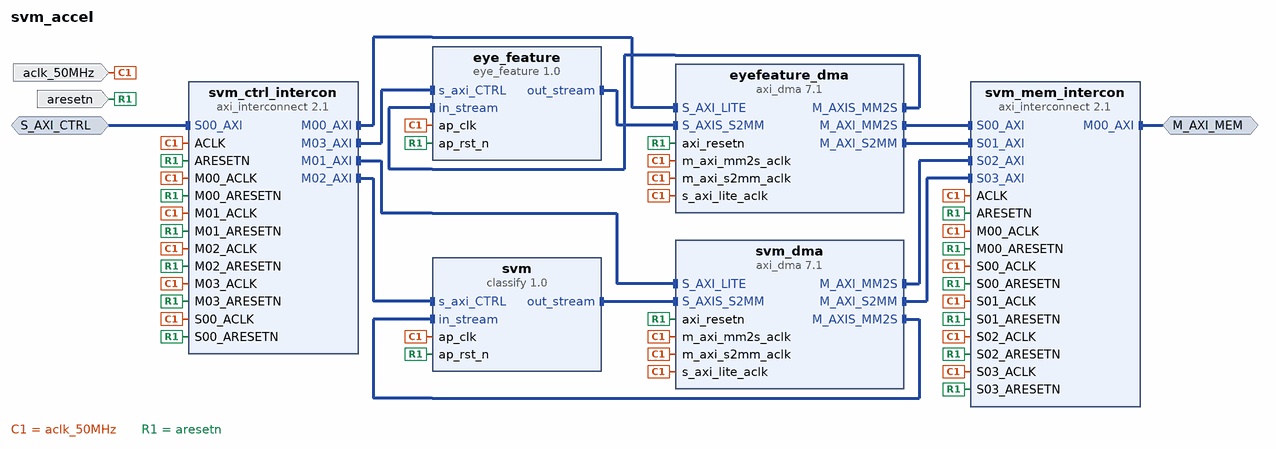
[diagram p0: block diagram of the top level]
# Vivado block design svm_accel, xc7z020clg400-1, Vivado 2023.2
create_bd_design svm_accel

create_bd_intf_port -mode Slave -vlnv xilinx.com:interface:aximm_rtl:1.0 S_AXI_CTRL
set_property -dict [list \
  CONFIG.ADDR_WIDTH 32 \
  CONFIG.ARUSER_WIDTH 0 \
  CONFIG.AWUSER_WIDTH 0 \
  CONFIG.BUSER_WIDTH 0 \
  CONFIG.DATA_WIDTH 32 \
  CONFIG.FREQ_HZ 50000000 \
  CONFIG.HAS_BRESP 1 \
  CONFIG.HAS_BURST 1 \
  CONFIG.HAS_CACHE 1 \
  CONFIG.HAS_LOCK 1 \
  CONFIG.HAS_PROT 1 \
  CONFIG.HAS_QOS 1 \
  CONFIG.HAS_REGION 0 \
  CONFIG.HAS_RRESP 1 \
  CONFIG.HAS_WSTRB 1 \
  CONFIG.ID_WIDTH 12 \
  CONFIG.MAX_BURST_LENGTH 16 \
  CONFIG.NUM_READ_OUTSTANDING 8 \
  CONFIG.NUM_READ_THREADS 4 \
  CONFIG.NUM_WRITE_OUTSTANDING 8 \
  CONFIG.NUM_WRITE_THREADS 4 \
  CONFIG.PROTOCOL AXI3 \
  CONFIG.READ_WRITE_MODE READ_WRITE \
  CONFIG.RUSER_BITS_PER_BYTE 0 \
  CONFIG.RUSER_WIDTH 0 \
  CONFIG.SUPPORTS_NARROW_BURST 0 \
  CONFIG.WUSER_BITS_PER_BYTE 0 \
  CONFIG.WUSER_WIDTH 0 \
] [get_bd_intf_ports S_AXI_CTRL]
create_bd_intf_port -mode Master -vlnv xilinx.com:interface:aximm_rtl:1.0 M_AXI_MEM
set_property -dict [list \
  CONFIG.ADDR_WIDTH 32 \
  CONFIG.DATA_WIDTH 64 \
  CONFIG.FREQ_HZ 50000000 \
  CONFIG.HAS_BURST 0 \
  CONFIG.HAS_LOCK 0 \
  CONFIG.HAS_QOS 0 \
  CONFIG.HAS_REGION 0 \
  CONFIG.NUM_READ_OUTSTANDING 8 \
  CONFIG.NUM_WRITE_OUTSTANDING 8 \
  CONFIG.PROTOCOL AXI3 \
] [get_bd_intf_ports M_AXI_MEM]
create_bd_port -dir I -type clk aclk_50MHz
set_property -dict {CONFIG.FREQ_HZ 50000000} [get_bd_ports aclk_50MHz]
create_bd_port -dir I -type rst aresetn

create_bd_cell -type ip -vlnv xilinx.com:ip:axi_dma:7.1 eyefeature_dma
set_property -dict {CONFIG.c_include_sg 0 CONFIG.c_sg_length_width 24} [get_bd_cells eyefeature_dma]
create_bd_cell -type ip -vlnv xilinx.com:ip:axi_dma:7.1 svm_dma
set_property -dict {CONFIG.c_include_sg 0 CONFIG.c_sg_length_width 24} [get_bd_cells svm_dma]
create_bd_cell -type ip -vlnv xilinx.com:ip:axi_interconnect:2.1 svm_mem_intercon
set_property -dict {CONFIG.NUM_MI 1 CONFIG.NUM_SI 4} [get_bd_cells svm_mem_intercon]
create_bd_cell -type ip -vlnv xilinx.com:hls:classify:1.0 svm
create_bd_cell -type ip -vlnv xilinx.com:hls:eye_feature:1.0 eye_feature
create_bd_cell -type ip -vlnv xilinx.com:ip:axi_interconnect:2.1 svm_ctrl_intercon
set_property -dict {CONFIG.NUM_MI 4} [get_bd_cells svm_ctrl_intercon]

# ---- connections ----

connect_bd_intf_net -intf_net S00_AXI_0_1 [get_bd_intf_ports S_AXI_CTRL] [get_bd_intf_pins svm_ctrl_intercon/S00_AXI]
connect_bd_intf_net -intf_net axi_dma_0_M_AXIS_MM2S [get_bd_intf_pins eyefeature_dma/M_AXIS_MM2S] [get_bd_intf_pins eye_feature/in_stream]
connect_bd_intf_net -intf_net axi_dma_0_M_AXI_MM2S [get_bd_intf_pins eyefeature_dma/M_AXI_MM2S] [get_bd_intf_pins svm_mem_intercon/S00_AXI]
connect_bd_intf_net -intf_net axi_dma_0_M_AXI_S2MM [get_bd_intf_pins eyefeature_dma/M_AXI_S2MM] [get_bd_intf_pins svm_mem_intercon/S01_AXI]
connect_bd_intf_net -intf_net axi_dma_1_M_AXIS_MM2S [get_bd_intf_pins svm_dma/M_AXIS_MM2S] [get_bd_intf_pins svm/in_stream]
connect_bd_intf_net -intf_net axi_dma_1_M_AXI_MM2S [get_bd_intf_pins svm_dma/M_AXI_MM2S] [get_bd_intf_pins svm_mem_intercon/S02_AXI]
connect_bd_intf_net -intf_net axi_dma_1_M_AXI_S2MM [get_bd_intf_pins svm_dma/M_AXI_S2MM] [get_bd_intf_pins svm_mem_intercon/S03_AXI]
connect_bd_intf_net -intf_net classify_0_out_stream [get_bd_intf_pins svm/out_stream] [get_bd_intf_pins svm_dma/S_AXIS_S2MM]
connect_bd_intf_net -intf_net eye_feature_0_out_stream [get_bd_intf_pins eye_feature/out_stream] [get_bd_intf_pins eyefeature_dma/S_AXIS_S2MM]
connect_bd_intf_net [get_bd_intf_pins svm_ctrl_intercon/M00_AXI] [get_bd_intf_pins eyefeature_dma/S_AXI_LITE]
connect_bd_intf_net [get_bd_intf_pins svm_ctrl_intercon/M01_AXI] [get_bd_intf_pins svm_dma/S_AXI_LITE]
connect_bd_intf_net [get_bd_intf_pins svm_ctrl_intercon/M02_AXI] [get_bd_intf_pins svm/s_axi_CTRL]
connect_bd_intf_net [get_bd_intf_pins svm_ctrl_intercon/M03_AXI] [get_bd_intf_pins eye_feature/s_axi_CTRL]
connect_bd_intf_net [get_bd_intf_ports M_AXI_MEM] [get_bd_intf_pins svm_mem_intercon/M00_AXI]
connect_bd_net -net processing_system7_0_FCLK_CLK0 [get_bd_ports aclk_50MHz] \
  [get_bd_pins svm_ctrl_intercon/S00_ACLK] [get_bd_pins eyefeature_dma/s_axi_lite_aclk] \
  [get_bd_pins svm_ctrl_intercon/M00_ACLK] [get_bd_pins svm_ctrl_intercon/ACLK] [get_bd_pins svm_dma/s_axi_lite_aclk] \
  [get_bd_pins svm_ctrl_intercon/M01_ACLK] [get_bd_pins svm/ap_clk] [get_bd_pins svm_ctrl_intercon/M02_ACLK] \
  [get_bd_pins eye_feature/ap_clk] [get_bd_pins svm_ctrl_intercon/M03_ACLK] [get_bd_pins eyefeature_dma/m_axi_mm2s_aclk] \
  [get_bd_pins svm_mem_intercon/S00_ACLK] [get_bd_pins svm_mem_intercon/M00_ACLK] [get_bd_pins svm_mem_intercon/ACLK] \
  [get_bd_pins eyefeature_dma/m_axi_s2mm_aclk] [get_bd_pins svm_mem_intercon/S01_ACLK] [get_bd_pins svm_dma/m_axi_mm2s_aclk] \
  [get_bd_pins svm_mem_intercon/S02_ACLK] [get_bd_pins svm_dma/m_axi_s2mm_aclk] [get_bd_pins svm_mem_intercon/S03_ACLK]
connect_bd_net -net rst_ps7_0_50M_peripheral_aresetn [get_bd_ports aresetn] \
  [get_bd_pins svm_ctrl_intercon/S00_ARESETN] [get_bd_pins eyefeature_dma/axi_resetn] \
  [get_bd_pins svm_ctrl_intercon/M00_ARESETN] [get_bd_pins svm_ctrl_intercon/ARESETN] [get_bd_pins svm_dma/axi_resetn] \
  [get_bd_pins svm_ctrl_intercon/M01_ARESETN] [get_bd_pins svm/ap_rst_n] [get_bd_pins svm_ctrl_intercon/M02_ARESETN] \
  [get_bd_pins eye_feature/ap_rst_n] [get_bd_pins svm_ctrl_intercon/M03_ARESETN] [get_bd_pins svm_mem_intercon/S00_ARESETN] \
  [get_bd_pins svm_mem_intercon/M00_ARESETN] [get_bd_pins svm_mem_intercon/ARESETN] \
  [get_bd_pins svm_mem_intercon/S01_ARESETN] [get_bd_pins svm_mem_intercon/S02_ARESETN] \
  [get_bd_pins svm_mem_intercon/S03_ARESETN]

# ---- address map ----
assign_bd_address -offset 0x00000000 -range 512M -target_address_space [get_bd_addr_spaces eyefeature_dma/Data_MM2S] [get_bd_addr_segs M_AXI_MEM/Reg]
assign_bd_address -offset 0x00000000 -range 512M -target_address_space [get_bd_addr_spaces eyefeature_dma/Data_S2MM] [get_bd_addr_segs M_AXI_MEM/Reg]
assign_bd_address -offset 0x00000000 -range 64K -target_address_space [get_bd_addr_spaces S_AXI_CTRL] [get_bd_addr_segs eye_feature/s_axi_CTRL/Reg]
assign_bd_address -offset 0x00010000 -range 64K -target_address_space [get_bd_addr_spaces S_AXI_CTRL] [get_bd_addr_segs eyefeature_dma/S_AXI_LITE/Reg]
assign_bd_address -offset 0x00020000 -range 64K -target_address_space [get_bd_addr_spaces S_AXI_CTRL] [get_bd_addr_segs svm/s_axi_CTRL/Reg]
assign_bd_address -offset 0x00030000 -range 64K -target_address_space [get_bd_addr_spaces S_AXI_CTRL] [get_bd_addr_segs svm_dma/S_AXI_LITE/Reg]
assign_bd_address -offset 0x00000000 -range 512M -target_address_space [get_bd_addr_spaces svm_dma/Data_MM2S] [get_bd_addr_segs M_AXI_MEM/Reg]
assign_bd_address -offset 0x00000000 -range 512M -target_address_space [get_bd_addr_spaces svm_dma/Data_S2MM] [get_bd_addr_segs M_AXI_MEM/Reg]

validate_bd_design
save_bd_design
